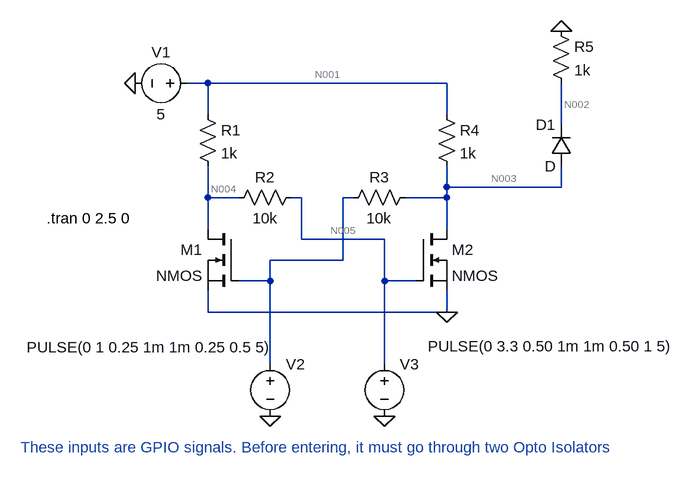
[diagram p0: schematic 411 Schematic.asc]
411 Schematic.asc, the LTspice schematic file:
Version 4
SHEET 1 940 680
WIRE 112 96 80 96
WIRE 480 96 112 96
WIRE 112 144 112 96
WIRE 480 144 480 96
WIRE 656 160 656 96
WIRE 480 256 480 224
WIRE 656 256 656 224
WIRE 656 256 480 256
WIRE 112 272 112 224
WIRE 160 272 112 272
WIRE 256 272 240 272
WIRE 336 272 320 272
WIRE 480 272 480 256
WIRE 480 272 416 272
WIRE 112 320 112 272
WIRE 480 320 480 272
WIRE 256 336 256 272
WIRE 384 336 256 336
WIRE 320 368 320 272
WIRE 320 368 208 368
WIRE 208 400 208 368
WIRE 208 400 160 400
WIRE 384 400 384 336
WIRE 432 400 384 400
WIRE 112 448 112 416
WIRE 480 448 480 416
WIRE 480 448 112 448
WIRE 208 528 208 400
WIRE 384 528 384 400
FLAG 0 96 0
FLAG 480 448 0
FLAG 208 608 0
FLAG 384 608 0
FLAG 656 16 0
SYMBOL voltage 96 96 R90
WINDOW 0 -32 56 VBottom 2
WINDOW 3 32 56 VTop 2
WINDOW 123 0 0 Left 2
WINDOW 39 0 0 Left 2
SYMATTR InstName V1
SYMATTR Value 5
SYMBOL res 96 128 R0
SYMATTR InstName R1
SYMATTR Value 1k
SYMBOL res 256 256 R90
WINDOW 0 0 56 VBottom 2
WINDOW 3 32 56 VTop 2
SYMATTR InstName R2
SYMATTR Value 10k
SYMBOL res 432 256 R90
WINDOW 0 0 56 VBottom 2
WINDOW 3 32 56 VTop 2
SYMATTR InstName R3
SYMATTR Value 10k
SYMBOL res 464 128 R0
SYMATTR InstName R4
SYMATTR Value 1k
SYMBOL nmos 160 320 M0
SYMATTR InstName M1
SYMBOL nmos 432 320 R0
SYMATTR InstName M2
SYMBOL voltage 208 512 R0
WINDOW 123 0 0 Left 2
WINDOW 39 0 0 Left 2
WINDOW 3 -375 -10 Left 2
SYMATTR Value PULSE(0 1 0.25 1m 1m 0.25 0.5 5)
SYMATTR InstName V2
SYMBOL voltage 384 512 R0
WINDOW 123 0 0 Left 2
WINDOW 39 0 0 Left 2
WINDOW 3 67 -11 Left 2
SYMATTR InstName V3
SYMATTR Value PULSE(0 3.3 0.50 1m 1m 0.50 1 5)
SYMBOL diode 672 224 R180
WINDOW 0 24 64 Left 2
WINDOW 3 24 0 Left 2
SYMATTR InstName D1
SYMBOL res 640 0 R0
SYMATTR InstName R5
SYMATTR Value 1k
TEXT -136 304 Left 2 !.tran 0 2.5 0
TEXT -176 656 Left 2 ;These inputs are GPIO signals. Before entering, it must go through two Opto Isolators

The netlist it stands for:
* 411 Schematic.asc
V1 N001 0 5
R1 N001 N004 1k
R2 N005 N004 10k
R3 N003 N006 10k
R4 N001 N003 1k
M1 N004 N006 0 0 NMOS
M2 N003 N005 0 0 NMOS
V2 N006 0 PULSE(0 1 0.25 1m 1m 0.25 0.5 5)
V3 N005 0 PULSE(0 3.3 0.50 1m 1m 0.50 1 5)
D1 N003 N002 D
R5 0 N002 1k
.model D D
.lib standard.dio
.model NMOS NMOS
.model PMOS PMOS
.lib standard.mos
.tran 0 2.5 0
* These inputs are GPIO signals. Before entering, it must go through two Opto Isolators
.backanno
.end

* Results of the author's LTspice run, read from the files saved beside the schematic
* Operating Point, zero values left out:
*   V(n001) = 5 V
*   V(n004) = 4.545 V
*   V(n003) = 2.702 V
*   V(n002) = 2.028 V
*   Id(M2) = 5.413 pA
*   Ib(M2) = -2.712 pA
*   Is(M2) = -2.702 pA
*   Id(M1) = 9.101 pA
*   Ib(M1) = -4.555 pA
*   Is(M1) = -4.545 pA
*   I(D1) = 2.028 mA
*   I(R5) = -2.028 mA
*   I(R4) = 2.298 mA
*   I(R3) = 270.2 µA
*   I(R2) = -454.5 µA
*   I(R1) = 454.5 µA
*   I(V3) = 454.5 µA
*   I(V2) = 270.2 µA
*   I(V1) = -2.753 mA
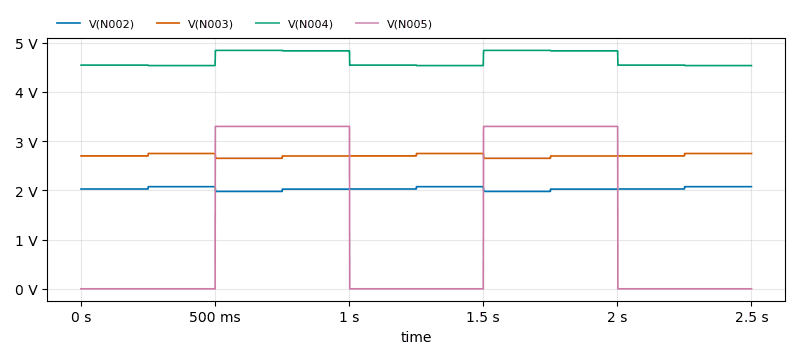
[diagram p1: Transient Analysis of 411 Schematic.asc, plotted from the saved traces]
* Transient Analysis, 1 run:
*   V(N002): min 1.979 V, max 2.076 V, average 2.032 V, rms 2.032 V, last 2.076 V
*   V(N003): min 2.651 V, max 2.75 V, average 2.705 V, rms 2.706 V, last 2.75 V
*   V(N004): min 4.536 V, max 4.845 V, average 4.661 V, rms 4.663 V, last 4.536 V
*   V(N005): min 0 V, max 3.3 V, average 1.323 V, rms 2.089 V, last 0 V